# Altium schematic sheet 电机驱动板-V5.0.SchDoc
size A2
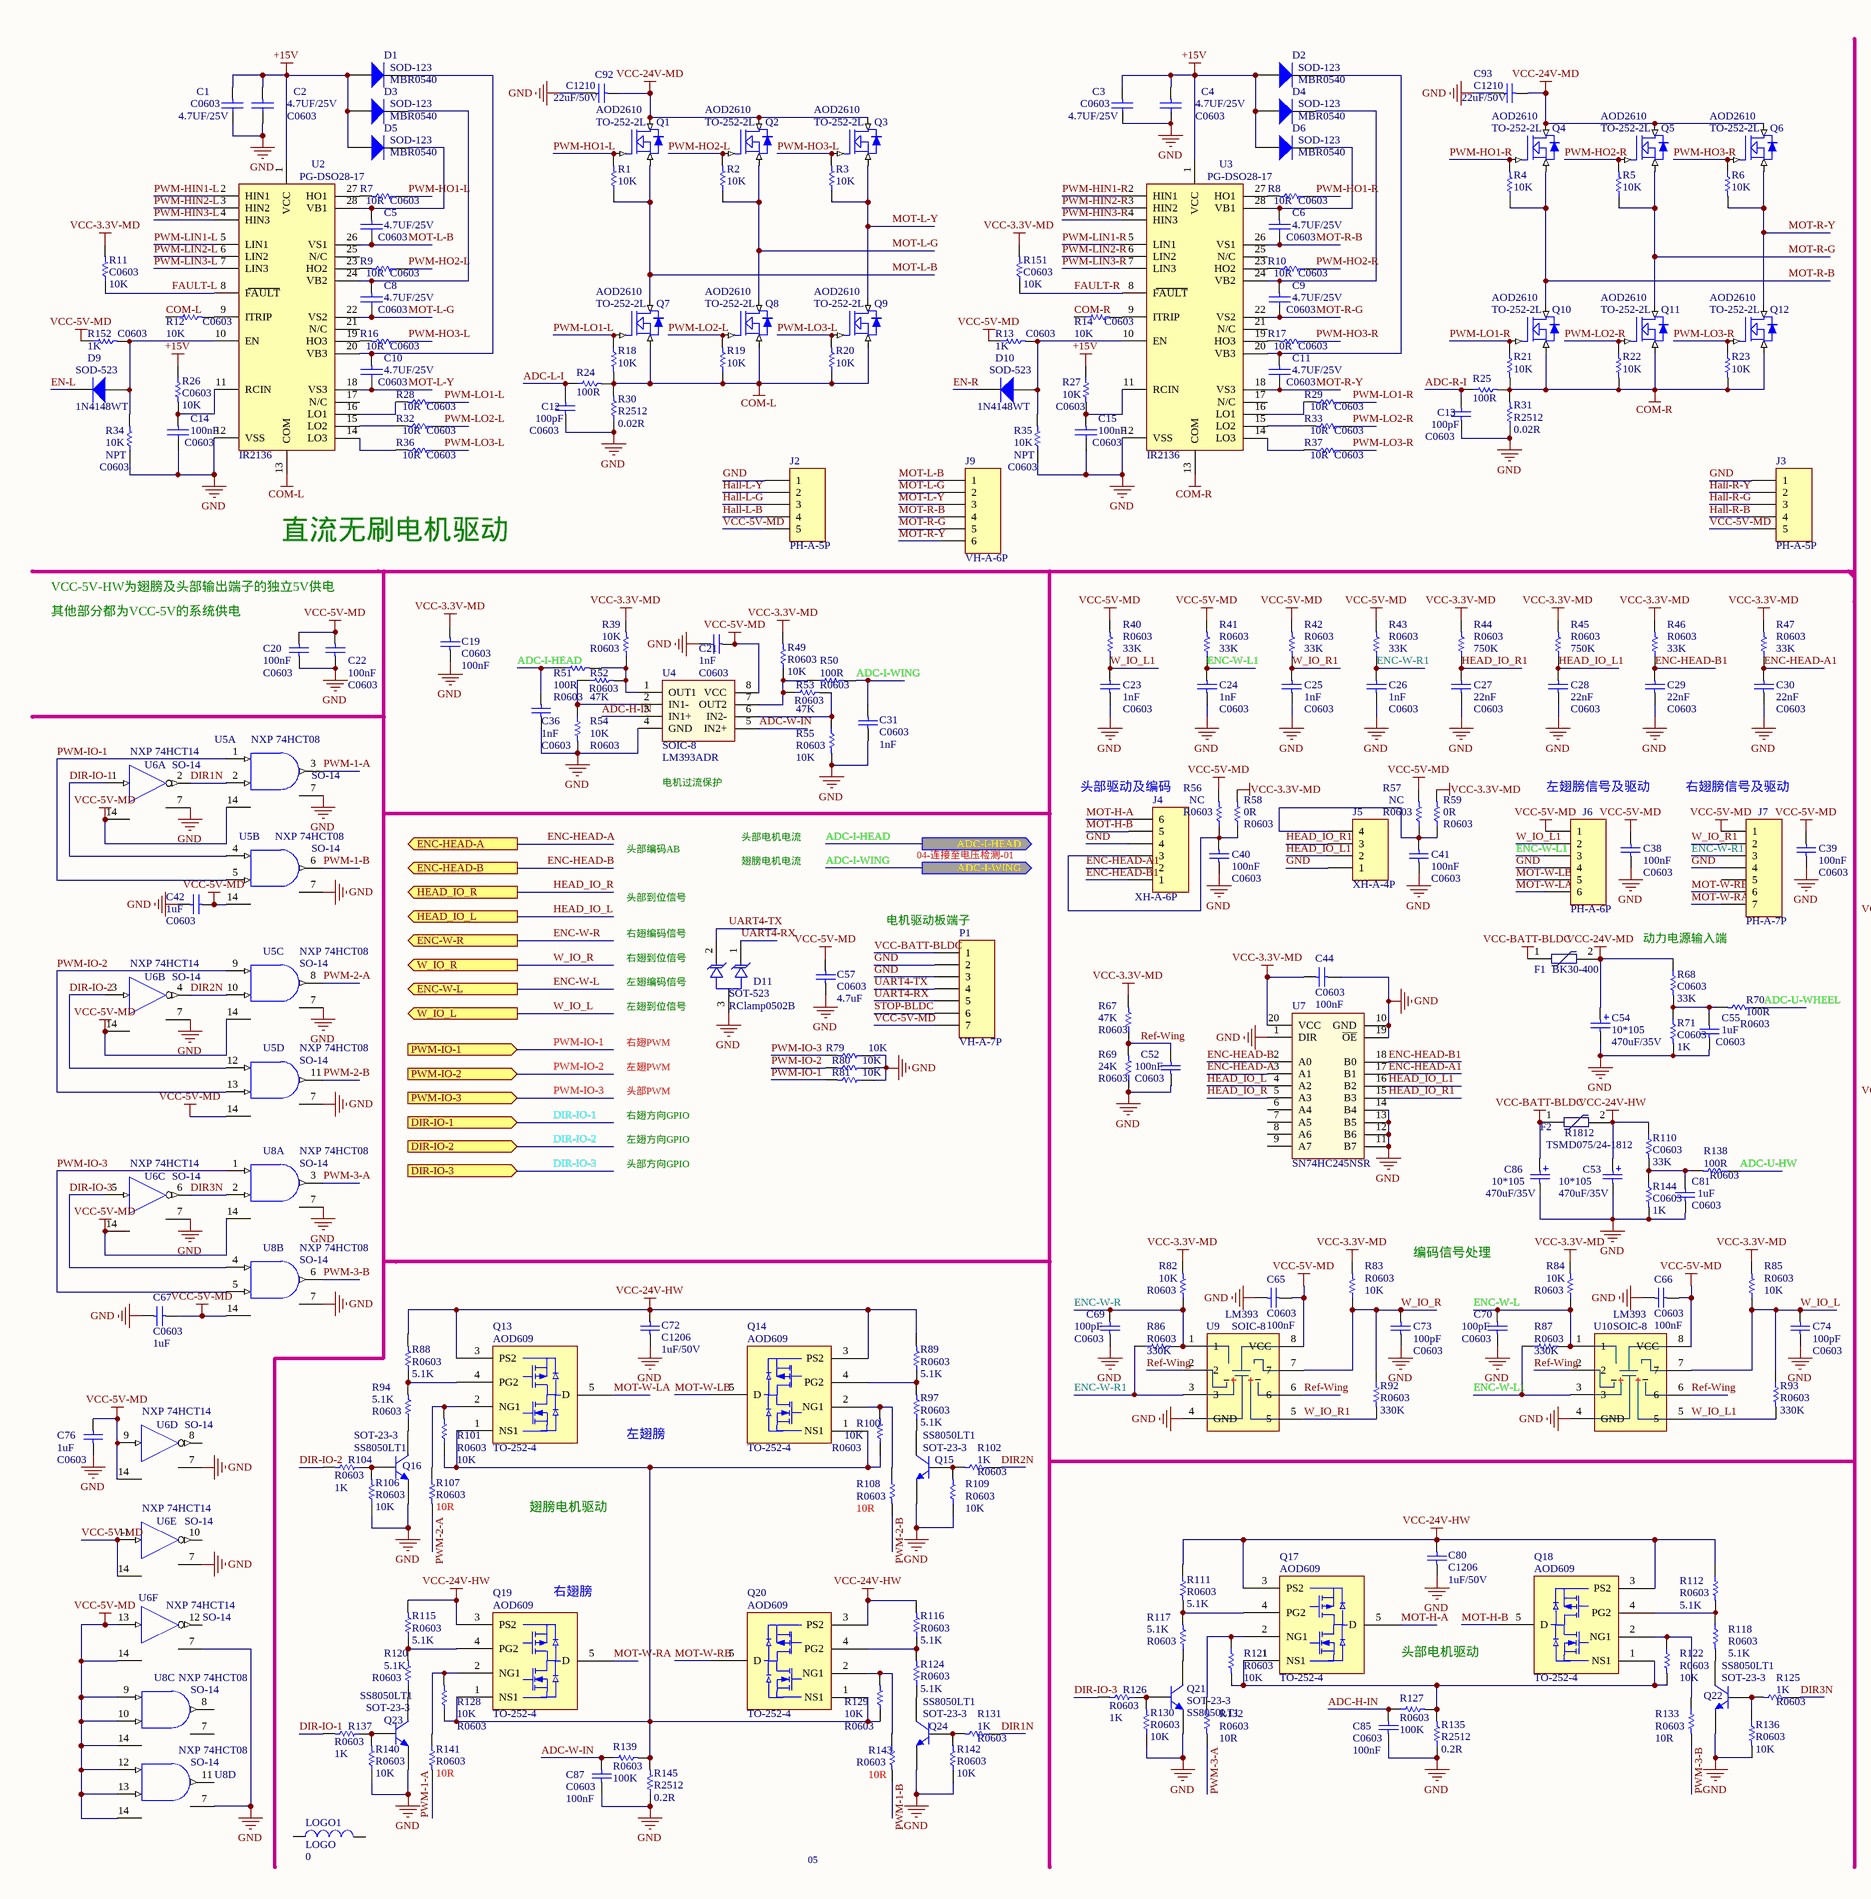
[diagram p0: 电机驱动板-V5.0.SchDoc, left]
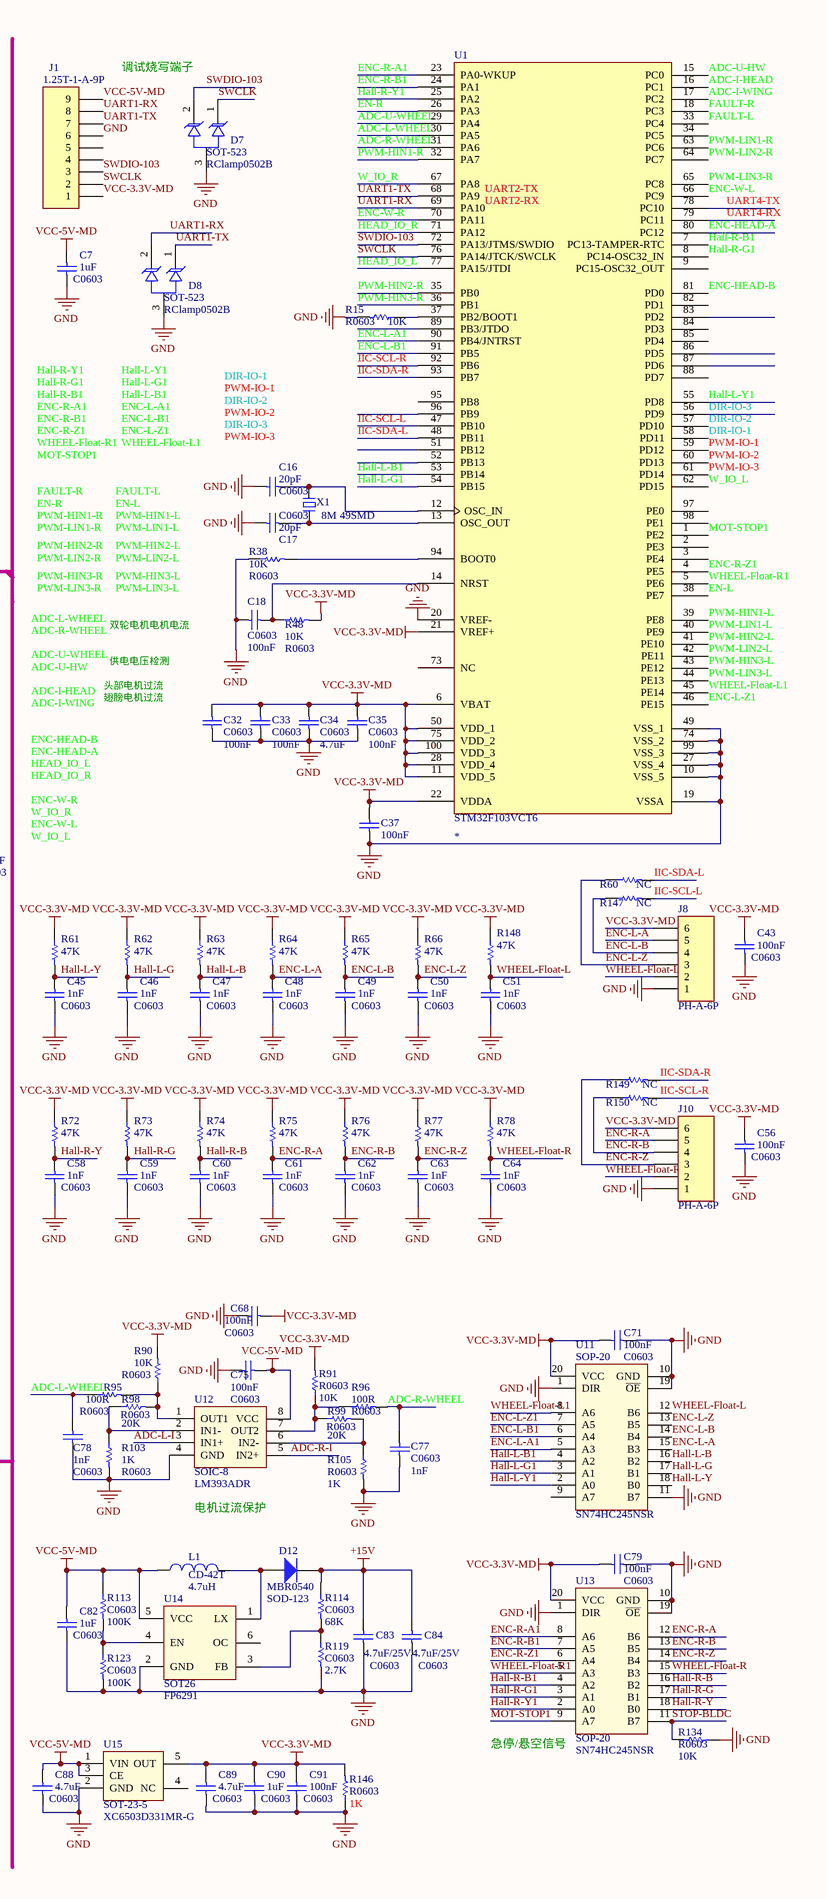
[diagram p1: 电机驱动板-V5.0.SchDoc, right]

## Parts
C1  C0603  value 4.7UF/25V  [C0603_M1608]
C2  C0603  value 4.7UF/25V  [C0603_M1608]
C3  C0603  value 4.7UF/25V  [C0603_M1608]
C4  C0603  value 4.7UF/25V  [C0603_M1608]
C5  C0603  value 4.7UF/25V  [C0603_M1608]
C6  C0603  value 4.7UF/25V  [C0603_M1608]
C7  C0603  value 1uF  [C0603_M1608]
C8  C0603  value 4.7UF/25V  [C0603_M1608]
C9  C0603  value 4.7UF/25V  [C0603_M1608]
C10  C0603  value 4.7UF/25V  [C0603_M1608]
C11  C0603  value 4.7UF/25V  [C0603_M1608]
C12  C0603  value 100pF  [C0603_M1608]
C13  C0603  value 100pF  [C0603_M1608]
C14  C0603  value 100nF  [C0603_M1608]
C15  C0603  value 100nF  [C0603_M1608]
C16  C0603  value 20pF  [C0603_M1608]
C17  C0603  value 20pF  [C0603_M1608]
C18  C0603  value 100nF  [C0603_M1608]
C19  C0603  value 100nF  [C0603_M1608]
C20  C0603  value 100nF  [C0603_M1608]
C21  C0603  value 1nF  [C0603_M1608]
C22  C0603  value 100nF  [C0603_M1608]
C23  C0603  value 1nF  [C0603_M1608]
C24  C0603  value 1nF  [C0603_M1608]
C25  C0603  value 1nF  [C0603_M1608]
C26  C0603  value 1nF  [C0603_M1608]
C27  C0603  value 22nF  [C0603_M1608]
C28  C0603  value 22nF  [C0603_M1608]
C29  C0603  value 22nF  [C0603_M1608]
C30  C0603  value 22nF  [C0603_M1608]
C31  C0603  value 1nF  [C0603_M1608]
C32  C0603  value 100nF  [C0603_M1608]
C33  C0603  value 100nF  [C0603_M1608]
C34  C0603  value 4.7uF  [C0603_M1608]
C35  C0603  value 100nF  [C0603_M1608]
C36  C0603  value 1nF  [C0603_M1608]
C37  value 100nF  [C0603_M1608]  (hidden comment: C0603)
C38  C0603  value 100nF  [C0603_M1608]
C39  C0603  value 100nF  [C0603_M1608]
C40  C0603  value 100nF  [C0603_M1608]
C41  C0603  value 100nF  [C0603_M1608]
C42  C0603  value 1uF  [C0603_M1608]
C43  C0603  value 100nF  [C0603_M1608]
C44  C0603  value 100nF  [C0603_M1608]
C45  C0603  value 1nF  [C0603_M1608]
C46  C0603  value 1nF  [C0603_M1608]
C47  C0603  value 1nF  [C0603_M1608]
C48  C0603  value 1nF  [C0603_M1608]
C49  C0603  value 1nF  [C0603_M1608]
C50  C0603  value 1nF  [C0603_M1608]
C51  C0603  value 1nF  [C0603_M1608]
C52  C0603  value 100nF  [C0603_M1608]
C53  10*105  value 470uF/35V  [CAP_SMD_10*105]
C54  10*105  value 470uF/35V  [CAP_SMD_10*105]
C55  C0603  value 1uF  [C0603_M1608]
C56  C0603  value 100nF  [C0603_M1608]
C57  C0603  value 4.7uF  [C0603_M1608]
C58  C0603  value 1nF  [C0603_M1608]
C59  C0603  value 1nF  [C0603_M1608]
C60  C0603  value 1nF  [C0603_M1608]
C61  C0603  value 1nF  [C0603_M1608]
C62  C0603  value 1nF  [C0603_M1608]
C63  C0603  value 1nF  [C0603_M1608]
C64  C0603  value 1nF  [C0603_M1608]
C65  C0603  value 100nF  [C0603_M1608]
C66  C0603  value 100nF  [C0603_M1608]
C67  C0603  value 1uF  [C0603_M1608]
C68  C0603  value 100nF  [C0603_M1608]
C69  C0603  value 100pF  [C0603_M1608]
C70  C0603  value 100pF  [C0603_M1608]
C71  C0603  value 100nF  [C0603_M1608]
C72  C1206  value 1uF/50V  [C1206_M3216]
C73  C0603  value 100pF  [C0603_M1608]
C74  C0603  value 100pF  [C0603_M1608]
C75  C0603  value 100nF  [C0603_M1608]
C76  C0603  value 1uF  [C0603_M1608]
C77  C0603  value 1nF  [C0603_M1608]
C78  C0603  value 1nF  [C0603_M1608]
C79  C0603  value 100nF  [C0603_M1608]
C80  C1206  value 1uF/50V  [C1206_M3216]
C81  C0603  value 1uF  [C0603_M1608]
C82  C0603  value 1uF  [C0603_M1608]
C83  C0603  value 4.7uF/25V  [C0603_M1608]
C84  C0603  value 4.7uF/25V  [C0603_M1608]
C85  C0603  value 100nF  [C0603_M1608]
C86  10*105  value 470uF/35V  [CAP_SMD_10*105]
C87  C0603  value 100nF  [C0603_M1608]
C88  C0603  value 4.7uF  [C0603_M1608]
C89  C0603  value 4.7uF  [C0603_M1608]
C90  C0603  value 1uF  [C0603_M1608]
C91  C0603  value 100nF  [C0603_M1608]
C92  C1210  value 22uF/50V  [C1210_M3225]
C93  C1210  value 22uF/50V  [C1210_M3225]
D1  SOD-123  value MBR0540  [SOD-123]
D2  SOD-123  value MBR0540  [SOD-123]
D3  SOD-123  value MBR0540  [SOD-123]
D4  SOD-123  value MBR0540  [SOD-123]
D5  SOD-123  value MBR0540  [SOD-123]
D6  SOD-123  value MBR0540  [SOD-123]
D7  SOT-523  value RClamp0502B  [SOT-523]
D8  SOT-523  value RClamp0502B  [SOT-523]
D9  SOD-523  value 1N4148WT  [SOD-523]
D10  SOD-523  value 1N4148WT  [SOD-523]
D11  SOT-523  value RClamp0502B  [SOT-523]
D12  SOD-123  value MBR0540  [SOD-123]
F1  BK30-400  [FUSE-FRG-5MM]
F2  R1812  value TSMD075/24-1812  [R1812_M4532]
J1  1.25T-1-A-9P  [1.25T-1-A-9P]
J2  PH-A-5P  [PH-A-5P]
J3  PH-A-5P  [PH-A-5P]
J4  XH-A-6P  [XH-A-6P]
J5  XH-A-4P  [XH-A-4P]
J6  PH-A-6P  [PH-A-6P]
J7  PH-A-7P  [PH-A-7P]
J8  PH-A-6P  [PH-A-6P]
J9  VH-A-6P  [VH-A-6P]
J10  PH-A-6P  [PH-A-6P]
L1  CD-42T  value 4.7uH  [CD-42T]
LOGO1  LOGO  value 0  [LOGO]
P1  VH-A-7P  [VH-A-7P]
Q1  TO-252-2L  value AOD2610  [TO-252-2L]
Q2  TO-252-2L  value AOD2610  [TO-252-2L]
Q3  TO-252-2L  value AOD2610  [TO-252-2L]
Q4  TO-252-2L  value AOD2610  [TO-252-2L]
Q5  TO-252-2L  value AOD2610  [TO-252-2L]
Q6  TO-252-2L  value AOD2610  [TO-252-2L]
Q7  TO-252-2L  value AOD2610  [TO-252-2L]
Q8  TO-252-2L  value AOD2610  [TO-252-2L]
Q9  TO-252-2L  value AOD2610  [TO-252-2L]
Q10  TO-252-2L  value AOD2610  [TO-252-2L]
Q11  TO-252-2L  value AOD2610  [TO-252-2L]
Q12  TO-252-2L  value AOD2610  [TO-252-2L]
Q13  TO-252-4  value AOD609  [TO-252-4L]
Q14  TO-252-4  value AOD609  [TO-252-4L]
Q15  SOT-23-3  value SS8050LT1  [SOT-23-3]
Q16  SOT-23-3  value SS8050LT1  [SOT-23-3]
Q17  TO-252-4  value AOD609  [TO-252-4L]
Q18  TO-252-4  value AOD609  [TO-252-4L]
Q19  TO-252-4  value AOD609  [TO-252-4L]
Q20  TO-252-4  value AOD609  [TO-252-4L]
Q21  SOT-23-3  value SS8050LT1  [SOT-23-3]
Q22  SOT-23-3  value SS8050LT1  [SOT-23-3]
Q23  SOT-23-3  value SS8050LT1  [SOT-23-3]
Q24  SOT-23-3  value SS8050LT1  [SOT-23-3]
R1  10K  [R0603_M1608]
R2  10K  [R0603_M1608]
R3  10K  [R0603_M1608]
R4  10K  [R0603_M1608]
R5  10K  [R0603_M1608]
R6  10K  [R0603_M1608]
R7  C0603  value 10R  [R0603_M1608]
R8  C0603  value 10R  [R0603_M1608]
R9  C0603  value 10R  [R0603_M1608]
R10  C0603  value 10R  [R0603_M1608]
R11  C0603  value 10K  [R0603_M1608]
R12  C0603  value 10K  [R0603_M1608]
R13  C0603  value 1K  [R0603_M1608]
R14  C0603  value 10K  [R0603_M1608]
R15  R0603  value 10K  [R0603_M1608]
R16  C0603  value 10R  [R0603_M1608]
R17  C0603  value 10R  [R0603_M1608]
R18  10K  [R0603_M1608]
R19  10K  [R0603_M1608]
R20  10K  [R0603_M1608]
R21  10K  [R0603_M1608]
R22  10K  [R0603_M1608]
R23  10K  [R0603_M1608]
R24  100R  [R0603_M1608]
R25  100R  [R0603_M1608]
R26  C0603  value 10K  [R0603_M1608]
R27  C0603  value 10K  [R0603_M1608]
R28  C0603  value 10R  [R0603_M1608]
R29  C0603  value 10R  [R0603_M1608]
R30  R2512  value 0.02R  [R2512_M6332]
R31  R2512  value 0.02R  [R2512_M6332]
R32  C0603  value 10R  [R0603_M1608]
R33  C0603  value 10R  [R0603_M1608]
R34  C0603  value 10K  [R0603_M1608]
R35  C0603  value 10K  [R0603_M1608]
R36  C0603  value 10R  [R0603_M1608]
R37  C0603  value 10R  [R0603_M1608]
R38  R0603  value 10K  [R0603_M1608]
R39  R0603  value 10K  [R0603_M1608]
R40  R0603  value 33K  [R0603_M1608]
R41  R0603  value 33K  [R0603_M1608]
R42  R0603  value 33K  [R0603_M1608]
R43  R0603  value 33K  [R0603_M1608]
R44  R0603  value 750K  [R0603_M1608]
R45  R0603  value 750K  [R0603_M1608]
R46  R0603  value 33K  [R0603_M1608]
R47  R0603  value 33K  [R0603_M1608]
R48  R0603  value 10K  [R0603_M1608]
R49  R0603  value 10K  [R0603_M1608]
R50  R0603  value 100R  [R0603_M1608]
R51  R0603  value 100R  [R0603_M1608]
R52  R0603  value 47K  [R0603_M1608]
R53  R0603  value 47K  [R0603_M1608]
R54  R0603  value 10K  [R0603_M1608]
R55  R0603  value 10K  [R0603_M1608]
R56  R0603  value NC  [R0603_M1608]
R57  R0603  value NC  [R0603_M1608]
R58  R0603  value 0R  [R0603_M1608]
R59  R0603  value 0R  [R0603_M1608]
R60  value NC  [R0603_M1608]  (hidden comment: C0603)
R61  value 47K  [R0603_M1608]  (hidden comment: C0603)
R62  value 47K  [R0603_M1608]  (hidden comment: C0603)
R63  value 47K  [R0603_M1608]  (hidden comment: C0603)
R64  value 47K  [R0603_M1608]  (hidden comment: C0603)
R65  value 47K  [R0603_M1608]  (hidden comment: C0603)
R66  value 47K  [R0603_M1608]  (hidden comment: C0603)
R67  R0603  value 47K  [R0603_M1608]
R68  C0603  value 33K  [R0603_M1608]
R69  R0603  value 24K  [R0603_M1608]
R70  R0603  value 100R  [R0603_M1608]
R71  C0603  value 1K  [R0603_M1608]
R72  value 47K  [R0603_M1608]  (hidden comment: C0603)
R73  value 47K  [R0603_M1608]  (hidden comment: C0603)
R74  value 47K  [R0603_M1608]  (hidden comment: C0603)
R75  value 47K  [R0603_M1608]  (hidden comment: C0603)
R76  value 47K  [R0603_M1608]  (hidden comment: C0603)
R77  value 47K  [R0603_M1608]  (hidden comment: C0603)
R78  value 47K  [R0603_M1608]  (hidden comment: C0603)
R79  value 10K  [R0603_M1608]  (hidden comment: R0603)
R80  value 10K  [R0603_M1608]  (hidden comment: R0603)
R81  value 10K  [R0603_M1608]  (hidden comment: R0603)
R82  R0603  value 10K  [R0603_M1608]
R83  R0603  value 10K  [R0603_M1608]
R84  R0603  value 10K  [R0603_M1608]
R85  R0603  value 10K  [R0603_M1608]
R86  R0603  value 330K  [R0603_M1608]
R87  R0603  value 330K  [R0603_M1608]
R88  R0603  value 5.1K  [R0603_M1608]
R89  R0603  value 5.1K  [R0603_M1608]
R90  R0603  value 10K  [R0603_M1608]
R91  R0603  value 10K  [R0603_M1608]
R92  R0603  value 330K  [R0603_M1608]
R93  R0603  value 330K  [R0603_M1608]
R94  R0603  value 5.1K  [R0603_M1608]
R95  R0603  value 100R  [R0603_M1608]
R96  R0603  value 100R  [R0603_M1608]
R97  R0603  value 5.1K  [R0603_M1608]
R98  R0603  value 20K  [R0603_M1608]
R99  R0603  value 20K  [R0603_M1608]
R100  R0603  value 10K  [R0603_M1608]
R101  R0603  value 10K  [R0603_M1608]
R102  R0603  value 1K  [R0603_M1608]
R103  R0603  value 1K  [R0603_M1608]
R104  R0603  value 1K  [R0603_M1608]
R105  R0603  value 1K  [R0603_M1608]
R106  R0603  value 10K  [R0603_M1608]
R107  R0603  value 10R  [R0603_M1608]
R108  R0603  value 10R  [R0603_M1608]
R109  R0603  value 10K  [R0603_M1608]
R110  C0603  value 33K  [R0603_M1608]
R111  R0603  value 5.1K  [R0603_M1608]
R112  R0603  value 5.1K  [R0603_M1608]
R113  C0603  value 100K  [R0603_M1608]
R114  C0603  value 68K  [R0603_M1608]
R115  R0603  value 5.1K  [R0603_M1608]
R116  R0603  value 5.1K  [R0603_M1608]
R117  R0603  value 5.1K  [R0603_M1608]
R118  R0603  value 5.1K  [R0603_M1608]
R119  C0603  value 2.7K  [R0603_M1608]
R120  R0603  value 5.1K  [R0603_M1608]
R121  R0603  value 10K  [R0603_M1608]
R122  R0603  value 10K  [R0603_M1608]
R123  C0603  value 100K  [R0603_M1608]
R124  R0603  value 5.1K  [R0603_M1608]
R125  R0603  value 1K  [R0603_M1608]
R126  R0603  value 1K  [R0603_M1608]
R127  R0603  value 100K  [R0603_M1608]
R128  R0603  value 10K  [R0603_M1608]
R129  R0603  value 10K  [R0603_M1608]
R130  R0603  value 10K  [R0603_M1608]
R131  R0603  value 1K  [R0603_M1608]
R132  R0603  value 10R  [R0603_M1608]
R133  R0603  value 10R  [R0603_M1608]
R134  R0603  value 10K  [R0603_M1608]
R135  R2512  value 0.2R  [R2512_M6332]
R136  R0603  value 10K  [R0603_M1608]
R137  R0603  value 1K  [R0603_M1608]
R138  R0603  value 100R  [R0603_M1608]
R139  R0603  value 100K  [R0603_M1608]
R140  R0603  value 10K  [R0603_M1608]
R141  R0603  value 10R  [R0603_M1608]
R142  R0603  value 10K  [R0603_M1608]
R143  R0603  value 10R  [R0603_M1608]
R144  C0603  value 1K  [R0603_M1608]
R145  R2512  value 0.2R  [R2512_M6332]
R146  R0603  value 1K  [R0603_M1608]
R147  value NC  [R0603_M1608]  (hidden comment: C0603)
R148  value 47K  [R0603_M1608]  (hidden comment: C0603)
R149  value NC  [R0603_M1608]  (hidden comment: C0603)
R150  value NC  [R0603_M1608]  (hidden comment: C0603)
R151  C0603  value 10K  [R0603_M1608]
R152  C0603  value 1K  [R0603_M1608]
U1  STM32F103VCT6  [LQFP100_N]
U2  PG-DSO28-17  value IR2136  [PG-DSO28-17]
U3  PG-DSO28-17  value IR2136  [PG-DSO28-17]
U4  SOIC-8  value LM393ADR  [SOIC-8]
U5  SO-14  value NXP 74HCT08  [SOP-14]  (parts A,B,C,D of 4)
U6  SO-14  value NXP 74HCT14  [SOP-14]  (parts A,B,C,D,E,F of 6)
U7  value SN74HC245NSR  [SOP-20]  (hidden comment: SOIC-20)
U8  SO-14  value NXP 74HCT08  [SOP-14]  (parts A,B,C,D of 4)
U9  SOIC-8  value LM393  [SOIC-8]
U10  SOIC-8  value LM393  [SOIC-8]
U11  SOP-20  value SN74HC245NSR  [SOP-20]
U12  SOIC-8  value LM393ADR  [SOIC-8]
U13  SOP-20  value SN74HC245NSR  [SOP-20]
U14  SOT26  value FP6291  [SOT26]
U15  SOT-23-5  value XC6503D331MR-G  [SOT-23-5]
X1  value 8M 49SMD  [HC-49SMD]

## Ports
ADC-I-HEAD (out), ADC-I-WING (out), DIR-IO-1 (in), DIR-IO-2 (in), DIR-IO-3 (in), ENC-HEAD-A (out), ENC-HEAD-B (out), ENC-W-L (out), ENC-W-R (out), HEAD_IO_L (out), HEAD_IO_R (out), PWM-IO-1 (in), PWM-IO-2 (in), PWM-IO-3 (in), W_IO_L (out), W_IO_R (out)

## Nets
+15V: C1.1 C2.1 C3.1 C4.1 C83.1 C84.1 D1.1(A) D2.1(A) D3.1(A) D4.1(A) D5.1(A) D6.1(A) D12.2(K) R26.1 R27.1 R114.1 U2.1(VCC) U3.1(VCC)
COM-L: Q7.2(S) Q8.2(S) Q9.2(S) R12.1 R18.2 R19.1 R20.1 R24.2 R30.2 U2.13(COM)
COM-R: Q10.2(S) Q11.2(S) Q12.2(S) R14.1 R21.2 R22.2 R23.2 R25.2 R31.2 U3.13(COM)
GND: C1.2 C2.2 C3.2 C4.2 C7.1 C12.2 C13.2 C14.2 C15.2 C16.1 C17.1 C18.1 C19.2 C20.1 C21.2 C22.1 C23.2 C24.2 C25.2 C26.2 C27.2 C28.2 C29.2 C30.2 C31.2 C32.1 C33.1 C34.1 C35.1 C36.2 C37.1 C38.2 C39.2 C40.2 C41.2 C42.1 C43.2 C44.1 C45.2 C46.2 C47.2 C48.2 C49.2 C50.2 C51.2 C52.2 C53.2 C54.2 C55.2 C56.2 C57.1 C58.2 C59.2 C60.2 C61.2 C62.2 C63.2 C64.2 C65.1 C66.1 C67.1 C68.2 C69.2 C70.2 C71.2 C72.1 C73.2 C74.2 C75.2 C76.2 C77.2 C78.2 C79.2 C80.1 C81.2 C82.2 C83.2 C84.2 C85.2 C86.2 C87.2 C88.1 C89.2 C90.2 C91.2 C92.1 C93.1 D7.3 D8.3 D11.3 J1.6 J2.1 J3.1 J4.4 J5.1 J6.4 J7.4 J8.1 J10.1 P1.2 P1.3 Q15.2(E) Q16.2(E) Q21.2(E) Q22.2(E) Q23.2(E) Q24.2(E) R15.2 R30.1 R31.1 R34.1 R35.1 R38.1 R54.2 R55.2 R69.1 R71.2 R79.1 R80.1 R81.1 R103.2 R105.2 R106.1 R109.1 R119.2 R123.2 R130.1 R134.1 R135.1 R136.2 R140.1 R142.1 R144.2 R145.1 R146.1 U1.10(VSS_5) U1.19(VSSA) U1.20(VREF-) U1.27(VSS_4) U1.49(VSS_1) U1.74(VSS_2) U1.99(VSS_3) U2.12(VSS) U3.12(VSS) U4.4(GND) U5.7(GND) U6.7(GND) U7.1(DIR) U7.10(GND) U7.11(B7) U7.12(B6) U7.13(B5) U7.14(B4) U7.19(~{OE}) U8.7(GND) U9.4(GND) U10.4(GND) U11.1(DIR) U11.10(GND) U11.11(B7) U11.19(~{OE}) U12.4(GND) U13.1(DIR) U13.10(GND) U13.19(~{OE}) U14.2(GND) U15.2(GND)
VCC-3.3V-MD: C19.1 C32.2 C33.2 C34.2 C35.2 C37.2 C43.1 C44.2 C56.1 C68.1 C71.1 C79.1 C89.1 C90.1 C91.1 J1.1 J8.6 J10.6 R11.2 R39.2 R44.2 R45.2 R46.2 R47.2 R48.2 R49.2 R58.2 R59.2 R61.1 R62.1 R63.1 R64.1 R65.1 R66.1 R67.2 R72.1 R73.1 R74.1 R75.1 R76.1 R77.1 R78.1 R82.2 R83.2 R84.2 R85.2 R90.2 R91.2 R146.2 R148.1 R151.2 U1.6(VBAT) U1.11(VDD_5) U1.21(VREF+) U1.22(VDDA) U1.28(VDD_4) U1.50(VDD_1) U1.75(VDD_2) U1.100(VDD_3) U7.20(VCC) U11.20(VCC) U13.20(VCC) U15.5(OUT)
VCC-5V-MD: C7.2 C20.2 C21.1 C22.2 C38.1 C39.1 C42.2 C57.2 C65.2 C66.2 C67.2 C75.1 C76.1 C82.1 C88.2 J1.9 J2.5 J3.5 J6.1 J7.1 L1.1 P1.7 R13.1 R40.2 R41.2 R42.2 R43.2 R56.2 R57.2 R113.1 R152.1 U4.8(VCC) U5.14(VCC) U6.9(A) U6.11(A) U6.13(A) U6.14(VCC) U8.9(A) U8.10(B) U8.12(A) U8.13(B) U8.14(VCC) U9.8(VCC) U10.8(VCC) U12.8(VCC) U14.5(VCC) U15.1(VIN) U15.3(CE)  [also labelled VCC]
VCC-24V-HW: C53.1 C72.2 C80.2 F2.2 Q13.3(PS2) Q14.3(PS2) Q17.3(PS2) Q18.3(PS2) Q19.3(PS2) Q20.3(PS2) R88.2 R89.2 R110.1 R111.1 R112.1 R115.2 R116.2
VCC-24V-MD: C54.1 C92.2 C93.2 F1.2 Q1.3(D) Q2.3(D) Q3.3(D) Q4.3(D) Q5.3(D) Q6.3(D) R68.1
VCC-BATT-BLDC: C86.1 F1.1 F2.1 P1.1
ADC-H-IN: C85.1 R127.1 U4.3(IN1+)
ADC-I-HEAD: C36.1 R51.1 U1.16(PC1) ; port ADC-I-HEAD
ADC-I-WING: C31.1 R50.2 U1.17(PC2) ; port ADC-I-WING
ADC-L-I: C12.1 R24.1 U12.3(IN1+)
ADC-L-WHEEL: C78.1 R95.1 U1.30(PA5)
ADC-R-I: C13.1 R25.1 U12.5(IN2+)
ADC-R-WHEEL: C77.1 R96.2 U1.31(PA6)
ADC-U-HW: R138.1 U1.15(PC0)
ADC-U-WHEEL: R70.1 U1.29(PA4)
ADC-W-IN: C87.1 R139.1 U4.5(IN2+)
DIR1N: R131.1 U5.2(B) U6.2(Y)
DIR2N: R102.1 U5.10(B) U6.4(Y)
DIR3N: R125.1 U6.6(Y) U8.2(B)
DIR-IO-1: R137.2 U1.58(PD11) U5.4(A) U6.1(A) ; port DIR-IO-1
DIR-IO-2: R104.2 U1.57(PD10) U5.12(A) U6.3(A) ; port DIR-IO-2
DIR-IO-3: R126.2 U1.56(PD9) U6.5(A) U8.4(A) ; port DIR-IO-3
EN-L: D9.2(K) U1.38(PE7)
EN-R: D10.2(K) U1.26(PA3)
ENC-HEAD-A: U1.80(PC12) U7.3(A1) ; port ENC-HEAD-A
ENC-HEAD-A1: C30.1 J4.2 R47.1 U7.17(B1)
ENC-HEAD-B: U1.81(PD0) U7.2(A0) ; port ENC-HEAD-B
ENC-HEAD-B1: C29.1 J4.1 R46.1 U7.18(B0)
ENC-L-A: C48.1 J8.5 R64.2 U11.15(B3)
ENC-L-A1: U1.90(PB4/JNTRST) U11.5(A3)
ENC-L-B: C49.1 J8.4 R65.2 R147.1 U11.14(B4)
ENC-L-B1: U1.91(PB5) U11.6(A4)
ENC-L-Z: C50.1 J8.3 R60.1 R66.2 U11.13(B5)
ENC-L-Z1: U1.46(PE15) U11.7(A5)
ENC-R-A: C61.1 J10.5 R75.2 U13.12(B6)
ENC-R-A1: U1.23(PA0-WKUP) U13.8(A6)
ENC-R-B: C62.1 J10.4 R76.2 R150.1 U13.13(B5)
ENC-R-B1: U1.24(PA1) U13.7(A5)
ENC-R-Z: C63.1 J10.3 R77.2 R149.1 U13.14(B4)
ENC-R-Z1: U1.4(PE5) U13.6(A4)
ENC-W-L: C70.1 R84.1 R87.2 U1.66(PC9) U10.1 ; port ENC-W-L
ENC-W-L1: C24.1 J6.3 R41.1 R87.1 U10.3
ENC-W-R: C69.1 R82.1 R86.2 U1.70(PA11) U9.1 ; port ENC-W-R
ENC-W-R1: C26.1 J7.3 R43.1 R86.1 U9.3
FAULT-L: R11.1 U1.33(PC4) U2.8(FAULT)
FAULT-R: R151.1 U1.18(PC3) U3.8(FAULT)
Hall-L-B: C47.1 J2.4 R63.2 U11.16(B2)
Hall-L-B1: U1.53(PB14) U11.4(A2)
Hall-L-G: C46.1 J2.3 R62.2 U11.17(B1)
Hall-L-G1: U1.54(PB15) U11.3(A1)
Hall-L-Y: C45.1 J2.2 R61.2 U11.18(B0)
Hall-L-Y1: U1.55(PD8) U11.2(A0)
Hall-R-B: C60.1 J3.4 R74.2 U13.16(B2)
Hall-R-B1: U1.7(PC13-TAMPER-RTC) U13.4(A2)
Hall-R-G: C59.1 J3.3 R73.2 U13.17(B1)
Hall-R-G1: U1.8(PC14-OSC32_IN) U13.3(A1)
Hall-R-Y: C58.1 J3.2 R72.2 U13.18(B0)
Hall-R-Y1: U1.25(PA2) U13.2(A0)
HEAD_IO_L: U1.77(PA15/JTDI) U7.4(A2) ; port HEAD_IO_L
HEAD_IO_L1: C28.1 J5.2 R45.1 U7.16(B2)
HEAD_IO_R: U1.71(PA12) U7.5(A3) ; port HEAD_IO_R
HEAD_IO_R1: C27.1 J5.3 R44.1 U7.15(B3)
IIC-SCL-L: R147.2 U1.47(PB10)
IIC-SCL-R: R150.2 U1.92(PB6)
IIC-SDA-L: R60.2 U1.48(PB11)
IIC-SDA-R: R149.2 U1.93(PB7)
MOT-H-A: J4.6 Q17.5(D)
MOT-H-B: J4.5 Q18.5(D)
MOT-L-B: C5.2 J9.1 Q1.2(S) Q7.3(D) R1.1 U2.26(VS1)
MOT-L-G: C8.2 J9.2 Q2.2(S) Q8.3(D) R2.1 U2.22(VS2)
MOT-L-Y: C10.2 J9.3 Q3.2(S) Q9.3(D) R3.1 U2.18(VS3)
MOT-R-B: C6.2 J9.4 Q4.2(S) Q10.3(D) R4.1 U3.26(VS1)
MOT-R-G: C9.2 J9.5 Q5.2(S) Q11.3(D) R5.1 U3.22(VS2)
MOT-R-Y: C11.2 J9.6 Q6.2(S) Q12.3(D) R6.2 U3.18(VS3)
MOT-STOP1: U1.1(PE2) U13.9(A7)
MOT-W-LA: J6.6 Q13.5(D)
MOT-W-LB: J6.5 Q14.5(D)
MOT-W-RA: J7.7 Q19.5(D)
MOT-W-RB: J7.6 Q20.5(D)
PWM-1-A: R141.2 U5.3(Y)
PWM-1-B: R143.2 U5.6(Y)
PWM-2-A: R107.2 U5.8(Y)
PWM-2-B: R108.2 U5.11(Y)
PWM-3-A: R132.2 U8.3(Y)
PWM-3-B: R133.2 U8.6(Y)
PWM-HIN1-L: U1.39(PE8) U2.2(HIN1)
PWM-HIN1-R: U1.32(PA7) U3.2(HIN1)
PWM-HIN2-L: U1.41(PE10) U2.3(HIN2)
PWM-HIN2-R: U1.35(PB0) U3.3(HIN2)
PWM-HIN3-L: U1.43(PE12) U2.4(HIN3)
PWM-HIN3-R: U1.36(PB1) U3.4(HIN3)
PWM-HO1-L: Q1.1(G) R1.2 R7.1
PWM-HO1-R: Q4.1(G) R4.2 R8.1
PWM-HO2-L: Q2.1(G) R2.2 R9.1
PWM-HO2-R: Q5.1(G) R5.2 R10.1
PWM-HO3-L: Q3.1(G) R3.2 R16.1
PWM-HO3-R: Q6.1(G) R6.1 R17.1
PWM-IO-1: R81.2 U1.59(PD12) U5.1(A) U5.5(B) ; port PWM-IO-1
PWM-IO-2: R80.2 U1.60(PD13) U5.9(A) U5.13(B) ; port PWM-IO-2
PWM-IO-3: R79.2 U1.61(PD14) U8.1(A) U8.5(B) ; port PWM-IO-3
PWM-LIN1-L: U1.40(PE9) U2.5(LIN1)
PWM-LIN1-R: U1.63(PC6) U3.5(LIN1)
PWM-LIN2-L: U1.42(PE11) U2.6(LIN2)
PWM-LIN2-R: U1.64(PC7) U3.6(LIN2)
PWM-LIN3-L: U1.44(PE13) U2.7(LIN3)
PWM-LIN3-R: U1.65(PC8) U3.7(LIN3)
PWM-LO1-L: Q7.1(G) R18.1 R28.1
PWM-LO1-R: Q10.1(G) R21.1 R29.1
PWM-LO2-L: Q8.1(G) R19.2 R32.1
PWM-LO2-R: Q11.1(G) R22.1 R33.1
PWM-LO3-L: Q9.1(G) R20.2 R36.1
PWM-LO3-R: Q12.1(G) R23.1 R37.1
Ref-Wing: C52.1 R67.1 R69.2 U9.2 U9.6 U10.2 U10.6
STOP-BLDC: P1.6 R134.2 U13.11(B7)
SWCLK: D7.1 J1.2 U1.76(PA14/JTCK/SWCLK)
SWDIO-103: D7.2 J1.3 U1.72(PA13/JTMS/SWDIO)
UART1-RX: D8.2 J1.8 U1.69(PA10)
UART1-TX: D8.1 J1.7 U1.68(PA9)
UART4-RX: D11.1 P1.5 U1.79(PC11)
UART4-TX: D11.2 P1.4 U1.78(PC10)
W_IO_L: C74.1 R85.1 R93.1 U1.62(PD15) U10.7 ; port W_IO_L
W_IO_L1: C23.1 J6.2 R40.1 R93.2 U10.5
W_IO_R: C73.1 R83.1 R92.1 U1.67(PA8) U9.7 ; port W_IO_R
W_IO_R1: C25.1 J7.2 R42.1 R92.2 U9.5
WHEEL-Float-L: C51.1 J8.2 R148.2 U11.12(B6)
WHEEL-Float-L1: U1.45(PE14) U11.8(A6)
WHEEL-Float-R: C64.1 J10.2 R78.2 U13.15(B3)
WHEEL-Float-R1: U1.5(PE6) U13.5(A3)
NetC5_1: C5.1 D5.2(K) U2.28(VB1)
NetC6_1: C6.1 D6.2(K) U3.28(VB1)
NetC8_1: C8.1 D3.2(K) U2.24(VB2)
NetC9_1: C9.1 D4.2(K) U3.24(VB2)
NetC10_1: C10.1 D1.2(K) U2.20(VB3)
NetC11_1: C11.1 D2.2(K) U3.20(VB3)
NetC14_1: C14.1 R26.2 U2.11(RCIN)
NetC15_1: C15.1 R27.2 U3.11(RCIN)
NetC16_2: C16.2 U1.12(OSC_IN) X1.2
NetC17_2: C17.2 U1.13(OSC_OUT) X1.1
NetC18_2: C18.2 R48.1 U1.14(NRST)
NetC40_1: C40.1 J4.3 R56.1 R58.1
NetC41_1: C41.1 J5.4 R57.1 R59.1
NetC55_1: C55.1 R68.2 R70.2 R71.1
NetC81_1: C81.1 R110.2 R138.2 R144.1
NetD9_1: D9.1(A) R34.2 R152.2 U2.10(EN)
NetD10_1: D10.1(A) R13.2 R35.2 U3.10(EN)
NetD12_1: D12.1(A) L1.2 U14.1(LX)
NetQ13_1: Q13.1(NS1) Q14.1(NS1) Q19.1(NS1) Q20.1(NS1) R100.1 R101.1 R128.1 R129.1 R139.2 R145.2
NetQ13_2: Q13.2(NG1) R101.2 R107.1
NetQ13_4: Q13.4(PG2) R88.1 R94.2
NetQ14_2: Q14.2(NG1) R100.2 R108.1
NetQ14_4: Q14.4(PG2) R89.1 R97.2
NetQ15_1: Q15.1(B) R102.2 R109.2
NetQ15_3: Q15.3(C) R97.1
NetQ16_1: Q16.1(B) R104.1 R106.2
NetQ16_3: Q16.3(C) R94.1
NetQ17_1: Q17.1(NS1) Q18.1(NS1) R121.2 R122.2 R127.2 R135.2
NetQ17_2: Q17.2(NG1) R121.1 R132.1
NetQ17_4: Q17.4(PG2) R111.2 R117.2
NetQ18_2: Q18.2(NG1) R122.1 R133.1
NetQ18_4: Q18.4(PG2) R112.2 R118.1
NetQ19_2: Q19.2(NG1) R128.2 R141.1
NetQ19_4: Q19.4(PG2) R115.1 R120.2
NetQ20_2: Q20.2(NG1) R129.2 R143.1
NetQ20_4: Q20.4(PG2) R116.1 R124.2
NetQ21_1: Q21.1(B) R126.1 R130.2
NetQ21_3: Q21.3(C) R117.1
NetQ22_1: Q22.1(B) R125.2 R136.1
NetQ22_3: Q22.3(C) R118.2
NetQ23_1: Q23.1(B) R137.1 R140.2
NetQ23_3: Q23.3(C) R120.1
NetQ24_1: Q24.1(B) R131.2 R142.2
NetQ24_3: Q24.3(C) R124.1
NetR7_2: R7.2 U2.27(HO1)
NetR8_2: R8.2 U3.27(HO1)
NetR9_2: R9.2 U2.23(HO2)
NetR10_2: R10.2 U3.23(HO2)
NetR12_2: R12.2 U2.9(ITRIP)
NetR14_2: R14.2 U3.9(ITRIP)
NetR15_1: R15.1 U1.37(PB2/BOOT1)
NetR16_2: R16.2 U2.19(HO3)
NetR17_2: R17.2 U3.19(HO3)
NetR28_2: R28.2 U2.16(LO1)
NetR29_2: R29.2 U3.16(LO1)
NetR32_2: R32.2 U2.15(LO2)
NetR33_2: R33.2 U3.15(LO2)
NetR36_2: R36.2 U2.14(LO3)
NetR37_2: R37.2 U3.14(LO3)
NetR38_2: R38.2 U1.94(BOOT0)
NetR39_1: R39.1 R51.2 R52.2 U4.1(OUT1)
NetR49_1: R49.1 R50.1 R53.1 U4.7(OUT2)
NetR52_1: R52.1 R54.1 U4.2(IN1-)
NetR53_2: R53.2 R55.1 U4.6(IN2-)
NetR90_1: R90.1 R95.2 R98.2 U12.1(OUT1)
NetR91_1: R91.1 R96.1 R99.1 U12.7(OUT2)
NetR98_1: R98.1 R103.1 U12.2(IN1-)
NetR99_2: R99.2 R105.1 U12.6(IN2-)
NetR113_2: R113.2 R123.1 U14.4(EN)
NetR114_2: R114.2 R119.1 U14.3(FB)

Not connected (* = marked no-connect by the designer): J1 4 5; J7 5; LOGO1 1 2; U1 2(PE3) 3(PE4) 9(PC15-OSC32_OUT) 34(PC5) 51(PB12) 52(PB13) 73(NC) 82(PD1) 83(PD2) 84(PD3) 85(PD4) 86(PD5) 87(PD6) 88(PD7) 89(PB3/JTDO) 95(PB8) 96(PB9) 97(PE0) 98(PE1); U2 17(N/C) 21(N/C) 25(N/C); U3 17(N/C) 21(N/C) 25(N/C); U6 8(Y) 10(Y) 12(Y); U7 6(A4) 7(A5) 8(A6) 9(A7); U8 8(Y) 11(Y); U11 9(A7); U14 6(OC); U15 4(NC)

## Notes on the sheet
- 调试烧写端子
- VCC-5V-HW为翅膀及头部输出端子的独立5V供电
- 直流无刷电机驱动
- 其他部分都为VCC-5V的系统供电
- 双轮电机电机电流
- 头部电机过流
- 翅膀电机过流
- 供电电压检测
- 电机过流保护
- 头部电机电流
- (near J4) 头部驱动及编码
- (near J6) 左翅膀信号及驱动
- (near J7) 右翅膀信号及驱动
- 头部编码AB
- 翅膀电机电流
- 04-连接至电压检测-01
- 头部到位信号
- 右翅编码信号
- 右翅到位信号
- (near P1) 电机驱动板端子
- (near R68) 动力电源输入端
- 左翅编码信号
- 左翅到位信号
- 左翅PWM
- 右翅PWM
- 头部PWM
- 右翅方向GPIO
- 头部方向GPIO
- 左翅方向GPIO
- 编码信号处理
- 左翅膀
- 翅膀电机驱动
- (near Q19) 右翅膀
- 头部电机驱动
- (near U13) 急停/悬空信号
- 05
- Labels drawn without touching a wire or pin: ADC-I-HEAD, ADC-I-WING, ADC-L-WHEEL, ADC-R-WHEEL, ADC-U-HW, ADC-U-WHEEL, DIR-IO-1, DIR-IO-2, DIR-IO-3, EN-L, EN-R, ENC-HEAD-A, ENC-HEAD-B, ENC-L-A1, ENC-L-B1, ENC-L-Z1, ENC-R-A1, ENC-R-B1, ENC-R-Z1, ENC-W-L, ENC-W-R, FAULT-L, FAULT-R, Hall-L-B1, Hall-L-G1, Hall-L-Y1, Hall-R-B1, Hall-R-G1, Hall-R-Y1, HEAD_IO_L, HEAD_IO_R, MOT-STOP1, PWM-HIN1-L, PWM-HIN1-R, PWM-HIN2-L, PWM-HIN2-R, PWM-HIN3-L, PWM-HIN3-R, PWM-IO-1, PWM-IO-2, PWM-IO-3, PWM-LIN1-L, PWM-LIN1-R, PWM-LIN2-L, PWM-LIN2-R, PWM-LIN3-L, PWM-LIN3-R, UART2-RX, UART2-TX, W_IO_L, W_IO_R, WHEEL-Float-L1, WHEEL-Float-R1
- (in symbol Res1) NPT

## Library data of the parts
C1-C6 C8-C11 C14 C15 = CAP: Capacitor
C7 C37 C42 C57 C67 C76 C83-C85 C87-C91 = Cap: Capacitor
  C37: Revision: July-2002: Re-released for DXP Platform.
  C42 C67 C76 C83 C85 C87 C88: Published: 8-Jun-2000; LatestRevisionDate: 17-Jul-2002; LatestRevisionNote: Re-released for DXP Platform.; PackageReference: RAD-0.3; Publisher: Altium Limited; PackageDescription: Radial Cap, Thru-Hole; 2 Leads; 0.3 in Pin Spacing
C12 C13 C16-C36 C38-C41 C43-C52 C55 C56 C58-C66 C68-C71 C73-C75 C77-C79 C81 C82 C92 C93 = MCC0603: Multilayer Ceramic Capacitor 0603
C53 C54 C86 = CAP_SMD_10*105: SMD Capacitor 10*105
C72 C80 = MCC1206: Multilayer Ceramic Capacitor 1206
D1-D6 D12 = Diode: Default Diode; Published: MBR0540; LatestRevisionNote: Re-released for DXP Platform.; PackageDocument: Sep-1996; PackageReference: SMC; Publisher: Altium Limited; Code_JEDEC: DO-214-AB
D7 D8 D11 = RClamp0502B: Ultra-Low Capacitance TVS for ESD and CDE Protection
D9 D10 = 1N4148WT: FAST SWITCHING DIODES
F1 F2 = PPTC
  F1: Value: BK30-400
J1 = 1.25T-1-A-9P: Header, 1.25mm,9-Pin; Value: 1.25T-1-A-9P
J2 J3 = PH-A-5P: Header, 2.0mm,5-Pin; Value: PH-A-5P
J4 = XH-A-6P: Header, 2.5mm,6-Pin; Value: XH-A-6P
J5 = XH-A-4P: Header, 2.5mm,4-Pin; Value: XH-A-4P
J6 J8 J10 = PH-A-6P: Header, 2.0mm,6-Pin; Value: PH-A-6P
J7 = PH-A-7P: Header, 2.0mm,7-Pin; Value: PH-A-7P
J9 = VH-A-6P: Header, 3.96mm,6-Pin; Value: VH-A-6P
L1 = L3*3*2-3A: Inductor
LOGO1 = L-CD54: Inductor CD54 Type
P1 = VH-A-7P: Header, 3.96mm,7-Pin; Value: VH-A-7P
Q1-Q12 = MOSN_1
Q13 Q14 Q17-Q20 = MOS-DUAL-N/P
Q15 Q16 Q21-Q24 = SS8050LT1: NPN Bipolar Transistor
R1-R14 R16-R29 R32-R37 R60-R66 R68 R70-R81 R88 R89 R94 R97 R100-R102 R104 R106-R110 R113-R117 R119 R120 R123-R131 R134 R136-R144 R146-R152 = Res1: Resistor
  R1-R6 R18-R23: Published: 8-Jun-2000; LatestRevisionDate: 17-Jul-2002; LatestRevisionNote: Re-released for DXP Platform.; PackageReference: AXIAL-0.3; Publisher: Altium Limited; PackageDescription: Axial Device, Thru-Hole; 2 Leads; 0.3 in Pin Spacing; Value: 10K
  R24 R25: Published: 8-Jun-2000; LatestRevisionDate: 17-Jul-2002; LatestRevisionNote: Re-released for DXP Platform.; PackageReference: AXIAL-0.3; Publisher: Altium Limited; PackageDescription: Axial Device, Thru-Hole; 2 Leads; 0.3 in Pin Spacing; Value: 100R
  R70 R79-R81 R88 R89 R94 R97 R100-R102 R104 R106-R109 R115-R117 R120 R124-R131 R134 R136-R143 R146: Published: 8-Jun-2000; LatestRevisionDate: 17-Jul-2002; LatestRevisionNote: Re-released for DXP Platform.; PackageReference: AXIAL-0.3; Publisher: Altium Limited; PackageDescription: Axial Device, Thru-Hole; 2 Leads; 0.3 in Pin Spacing
R15 R38-R59 R67 R69 R82-R87 R90-R93 R95 R96 R98 R99 R103 R105 R111 R112 R118 R121 R122 R132 R133 = R0603_M1608: Resistor
R30 R31 R135 R145 = R2512_M6332: Resistor
U1 = STM32F103V8T6: Value: *
U2 U3 = 6EDL04N02
U4 U12 = LM393ADR: Dual Differential Comparators
U5 U8 = SN74AHCT08N: Quadruple 2-Input Positive-AND Gate; Published: 8-Jun-2000; LatestRevisionDate: 04-Mar-2005; LatestRevisionNote: Stylized 3D Model Added.; DatasheetVersion: Oct-1998; PackageVersion: Oct-1995; PackageReference: N014; Publisher: Altium Limited; PackageDescription: DIP; 14 Leads; Row Spacing 7.62 mm; Pitch 2.54 mm; ComponentLink1Description: Manufacturer Link; ComponentLink1URL: http://www.ti.com/; ComponentLink2URL: http://www-s.ti.com/sc/ds/sn74ahct08.pdf; ComponentLink3Description: Packaging Specification; ComponentLink3URL: http://focus.ti.com/lit/ml/mpdi002c/mpdi002c.pdf
U6 = SN74ACT14N: Hex Schmitt-Trigger Inverter; Published: 8-Jun-2000; LatestRevisionDate: 04-Mar-2005; LatestRevisionNote: Stylized 3D Model Added.; DatasheetVersion: Mar-1998; PackageVersion: Oct-1995; PackageReference: N014; Publisher: Altium Limited; PackageDescription: DIP; 14 Leads; Row Spacing 7.62 mm; Pitch 2.54 mm; ComponentLink1Description: Manufacturer Link; ComponentLink1URL: http://www.ti.com/; ComponentLink2URL: http://www-s.ti.com/sc/ds/sn74act14.pdf; ComponentLink3Description: Packaging Specification; ComponentLink3URL: http://focus.ti.com/lit/ml/mpdi002c/mpdi002c.pdf
U7 = SN74HC245NSR: Octal Bus Transceivers With 3-State Outputs
U9 U10 = OP
U11 U13 = 74HC245
U14 = FP6291
U15 = XC6503D331MR-G: Capacitor-Less 500mA Low Power Consumption High Speed LDO Regulator
X1 = XTAL